# EAGLE design helilights_rev_1b_9-9-10 (EAGLE 5.10)
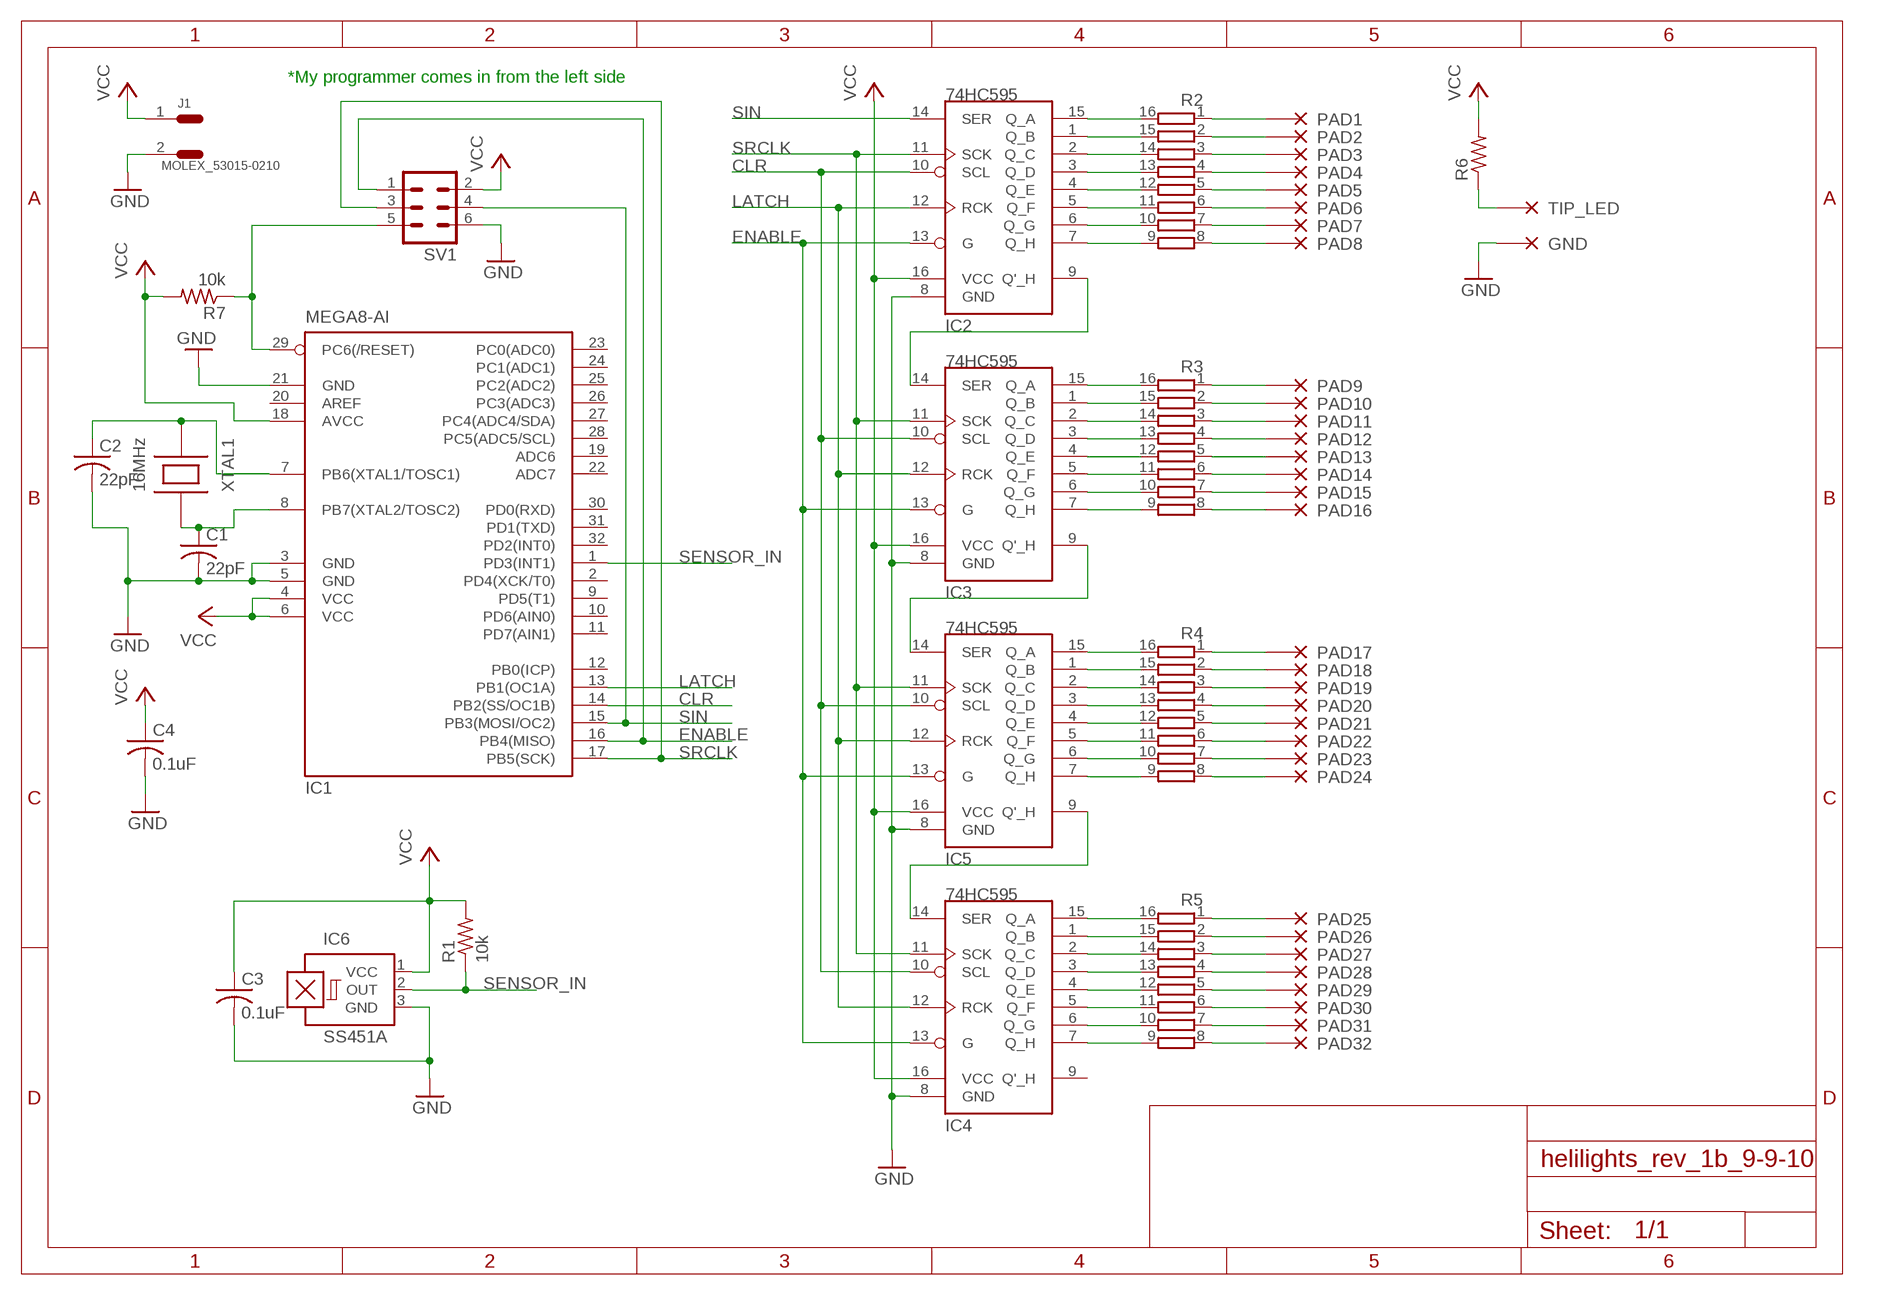
[diagram p0: schematic, sheet 1]

## Parts
C1  22pF  C-USC0603  [C0603]
C2  22pF  C-USC0603  [C0603]
C3  0.1uF  C-USC0603  [C0603]
C4  0.1uF  C-USC0603  [C0603]
GND  PAD_1X2MM  [1X2]
IC1  MEGA8-AI  [TQFP32-08]
IC2  74HC595  [TSSOP16]
IC3  74HC595  [TSSOP16]
IC4  74HC595  [TSSOP16]
IC5  74HC595  [TSSOP16]
IC6  SS451A  A1202LH  [SOT23-W]
J1  MOLEX_53015-0210  [53015-0210]
PAD1  PAD_1X2MM  [1X2]
PAD2  PAD_1X2MM  [1X2]
PAD3  PAD_1X2MM  [1X2]
PAD4  PAD_1X2MM  [1X2]
PAD5  PAD_1X2MM  [1X2]
PAD6  PAD_1X2MM  [1X2]
PAD7  PAD_1X2MM  [1X2]
PAD8  PAD_1X2MM  [1X2]
PAD9  PAD_1X2MM  [1X2]
PAD10  PAD_1X2MM  [1X2]
PAD11  PAD_1X2MM  [1X2]
PAD12  PAD_1X2MM  [1X2]
PAD13  PAD_1X2MM  [1X2]
PAD14  PAD_1X2MM  [1X2]
PAD15  PAD_1X2MM  [1X2]
PAD16  PAD_1X2MM  [1X2]
PAD17  PAD_1X2MM  [1X2]
PAD18  PAD_1X2MM  [1X2]
PAD19  PAD_1X2MM  [1X2]
PAD20  PAD_1X2MM  [1X2]
PAD21  PAD_1X2MM  [1X2]
PAD22  PAD_1X2MM  [1X2]
PAD23  PAD_1X2MM  [1X2]
PAD24  PAD_1X2MM  [1X2]
PAD25  PAD_1X2MM  [1X2]
PAD26  PAD_1X2MM  [1X2]
PAD27  PAD_1X2MM  [1X2]
PAD28  PAD_1X2MM  [1X2]
PAD29  PAD_1X2MM  [1X2]
PAD30  PAD_1X2MM  [1X2]
PAD31  PAD_1X2MM  [1X2]
PAD32  PAD_1X2MM  [1X2]
R1  10k  R-US_R0603  [R0603]
R2  4816P-T01  [4816P]
R3  4816P-T01  [4816P]
R4  4816P-T01  [4816P]
R5  4816P-T01  [4816P]
R6  R-US_0207/7  [0207/7]
R7  10k  R-US_0207/7  [0207/7]
SV1  MA03-2  [MA03-2]
TIP_LED  PAD_1X2MM  [1X2]
XTAL1  16MHz  CRYSTAL  [XTAL-6X3.3MM]

## Nets
CLR: IC1.14(PB2(SS/OC1B)) IC2.10(SCL) IC3.10(SCL) IC4.10(SCL) IC5.10(SCL)
ENABLE: IC1.16(PB4(MISO)) IC2.13(G) IC3.13(G) IC4.13(G) IC5.13(G) SV1.1
GND [Grounds]: C1.2 C2.2 C3.2 C4.2 GND.P$1(PAD) IC1.3(GND) IC1.5(GND) IC1.21(GND) IC2.8(GND) IC3.8(GND) IC4.8(GND) IC5.8(GND) IC6.3(GND) J1.2 SV1.6
LATCH: IC1.13(PB1(OC1A)) IC2.12(RCK) IC3.12(RCK) IC4.12(RCK) IC5.12(RCK)
N$1: C2.1 IC1.7(PB6(XTAL1/TOSC1)) XTAL1.2
N$2: C1.1 IC1.8(PB7(XTAL2/TOSC2)) XTAL1.1
N$3: IC2.15(Q_A) R2.16
N$4: IC2.1(Q_B) R2.15
N$5: IC2.9(Q'_H) IC3.14(SER)
N$6: IC3.9(Q'_H) IC5.14(SER)
N$7: IC4.14(SER) IC5.9(Q'_H)
N$8: IC2.2(Q_C) R2.14
N$9: IC2.3(Q_D) R2.13
N$10: IC2.4(Q_E) R2.12
N$11: IC2.5(Q_F) R2.11
N$12: IC2.6(Q_G) R2.10
N$13: IC2.7(Q_H) R2.9
N$14: IC3.15(Q_A) R3.16
N$15: IC3.1(Q_B) R3.15
N$16: IC3.2(Q_C) R3.14
N$17: IC3.3(Q_D) R3.13
N$18: IC3.4(Q_E) R3.12
N$19: IC3.5(Q_F) R3.11
N$20: IC3.6(Q_G) R3.10
N$21: IC3.7(Q_H) R3.9
N$22: IC5.15(Q_A) R4.16
N$23: IC5.1(Q_B) R4.15
N$24: IC5.2(Q_C) R4.14
N$25: IC5.3(Q_D) R4.13
N$26: IC5.4(Q_E) R4.12
N$27: IC5.5(Q_F) R4.11
N$28: IC5.6(Q_G) R4.10
N$29: IC5.7(Q_H) R4.9
N$30: IC4.15(Q_A) R5.16
N$31: IC4.1(Q_B) R5.15
N$32: IC4.2(Q_C) R5.14
N$33: IC4.3(Q_D) R5.13
N$34: IC4.4(Q_E) R5.12
N$35: IC4.5(Q_F) R5.11
N$36: IC4.6(Q_G) R5.10
N$37: IC4.7(Q_H) R5.9
N$38: PAD1.P$1(PAD) R2.1
N$39: PAD2.P$1(PAD) R2.2
N$40: PAD3.P$1(PAD) R2.3
N$41: PAD4.P$1(PAD) R2.4
N$42: PAD5.P$1(PAD) R2.5
N$43: PAD6.P$1(PAD) R2.6
N$44: PAD7.P$1(PAD) R2.7
N$45: PAD8.P$1(PAD) R2.8
N$46: PAD9.P$1(PAD) R3.1
N$47: PAD10.P$1(PAD) R3.2
N$48: PAD11.P$1(PAD) R3.3
N$49: PAD12.P$1(PAD) R3.4
N$50: PAD13.P$1(PAD) R3.5
N$51: PAD14.P$1(PAD) R3.6
N$52: PAD15.P$1(PAD) R3.7
N$53: PAD16.P$1(PAD) R3.8
N$54: PAD17.P$1(PAD) R4.1
N$55: PAD18.P$1(PAD) R4.2
N$56: PAD19.P$1(PAD) R4.3
N$57: PAD20.P$1(PAD) R4.4
N$58: PAD21.P$1(PAD) R4.5
N$59: PAD22.P$1(PAD) R4.6
N$60: PAD23.P$1(PAD) R4.7
N$61: PAD24.P$1(PAD) R4.8
N$62: PAD25.P$1(PAD) R5.1
N$63: PAD26.P$1(PAD) R5.2
N$64: PAD27.P$1(PAD) R5.3
N$65: PAD28.P$1(PAD) R5.4
N$66: PAD29.P$1(PAD) R5.5
N$67: PAD30.P$1(PAD) R5.6
N$68: PAD31.P$1(PAD) R5.7
N$69: PAD32.P$1(PAD) R5.8
N$70: R6.1 TIP_LED.P$1(PAD)
N$73: IC1.29(PC6(/RESET)) R7.1 SV1.5
SENSOR_IN: IC1.1(PD3(INT1)) IC6.2(OUT) R1.1
SIN: IC1.15(PB3(MOSI/OC2)) IC2.14(SER) SV1.4
SRCLK: IC1.17(PB5(SCK)) IC2.11(SCK) IC3.11(SCK) IC4.11(SCK) IC5.11(SCK) SV1.3
VCC [Power]: C3.1 C4.1 IC1.4(VCC) IC1.6(VCC) IC1.18(AVCC) IC2.16(VCC) IC3.16(VCC) IC4.16(VCC) IC5.16(VCC) IC6.1(VCC) J1.1 R1.2 R6.2 R7.2 SV1.2
Unconnected: IC1.2(PD4(XCK/T0)) IC1.9(PD5(T1)) IC1.10(PD6(AIN0)) IC1.11(PD7(AIN1)) IC1.12(PB0(ICP)) IC1.19(ADC6) IC1.20(AREF) IC1.22(ADC7) IC1.23(PC0(ADC0)) IC1.24(PC1(ADC1)) IC1.25(PC2(ADC2)) IC1.26(PC3(ADC3)) IC1.27(PC4(ADC4/SDA)) IC1.28(PC5(ADC5/SCL)) IC1.30(PD0(RXD)) IC1.31(PD1(TXD)) IC1.32(PD2(INT0)) IC4.9(Q'_H)

## Notes on the sheet
- *My programmer comes in from the left side

## Library data of the parts
C1-C4 = rcl:C-US: CAPACITOR, American symbol
GND PAD1-PAD32 TIP_LED = ZiwiskyLib:PAD_1X2MM: 1 x 2mm pad for wire connections
IC1 = atmel:MEGA8: MICROCONTROLLER 8 Kbytes FLASH, 1 kbytes SRAM, 512 bytes EEPROM, USART, 6-channel 10 bit ADC, 2-channel 8 bit ADC Pin compatible with Atmega48, ATMega88, ATMega168 Source: avr.lbr
IC2-IC5 = ZiwiskyLib:74HC595: 8-bit shift register with output latch
IC6 = allegro:A12*?: Hall-effect bipolar switch Source: http://www.allegromicro.com/en/Products/Part_Numbers/1202/1202.pdf
J1 = ZiwiskyLib:MOLEX_53015-0210
R1 = rcl:R-US_: RESISTOR, American symbol
R2-R5 = resistor-bourns:4816P-T01: BOURNS RESISTOR NETWORK
R6 R7 = resistor:R-US_: RESISTOR, American symbol
SV1 = con-lstb:MA03-2: PIN HEADER
XTAL1 = ZiwiskyLib:CRYSTAL: crystal

## Net classes
1 Grounds: width 0.508 mm
2 Power: width 0.508 mm

## Board
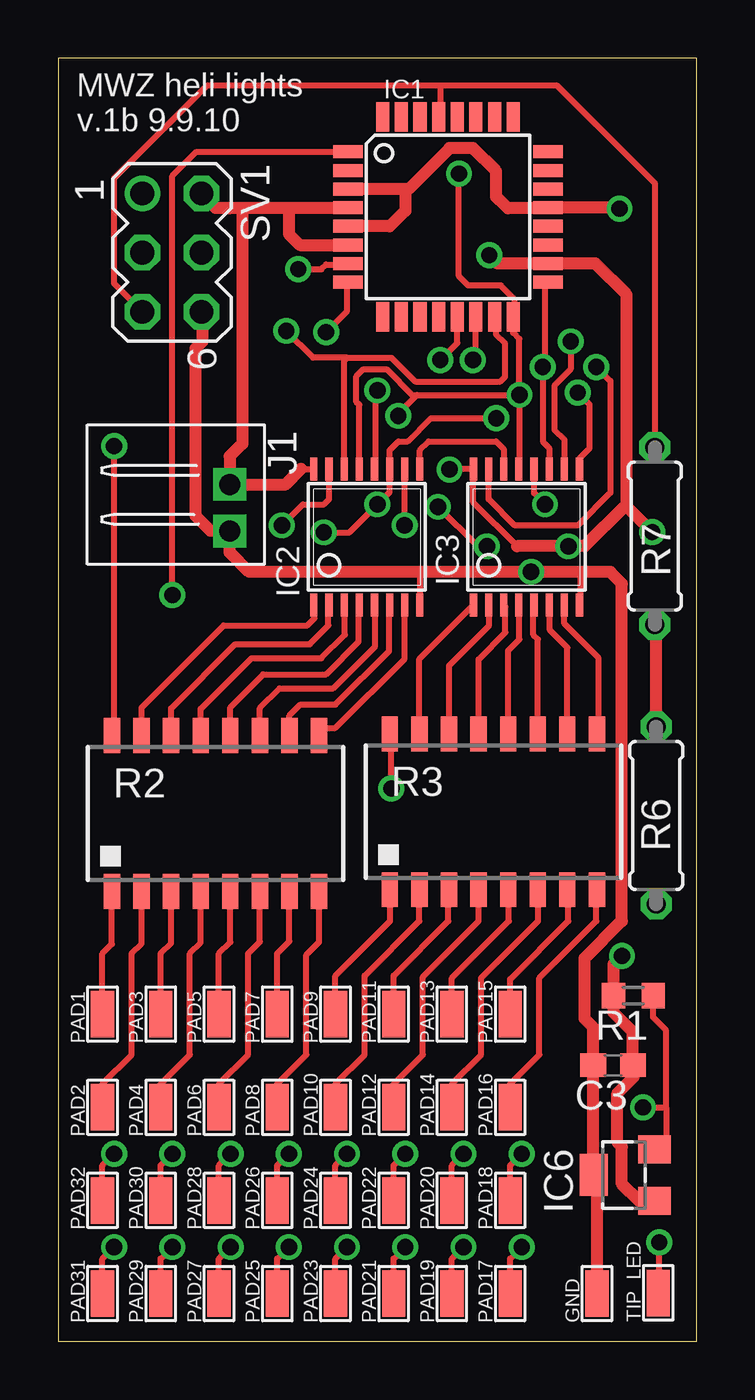
[diagram p1: board, top side]
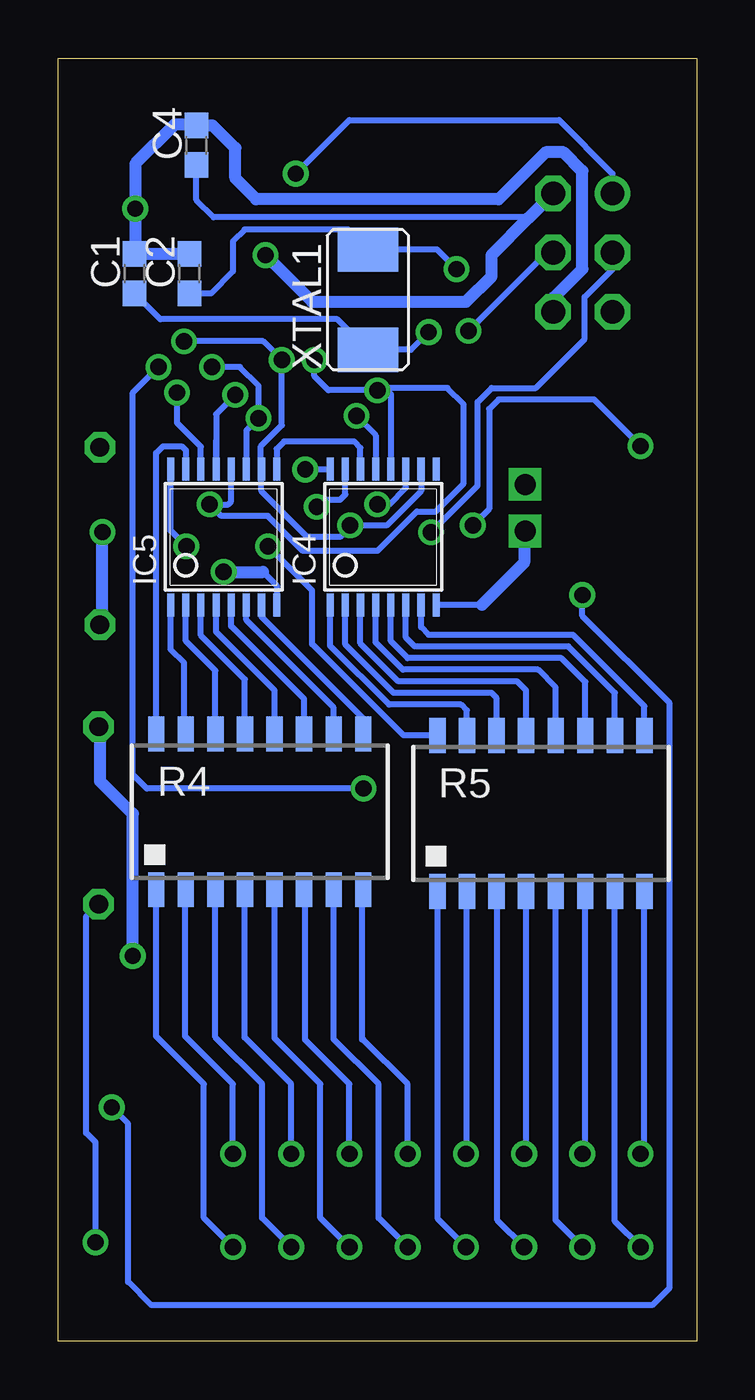
[diagram p2: board, bottom side, seen from below]

Size 27.4 x 55.1 mm. Coordinates in mm from the lower left corner, seen from the top.
Outline: 0,0 27.4,0 27.4,55.1 0,55.1 0,0
Copper layers (1*16): Top 0.035mm / dielectric 1.5mm / Bottom 0.035mm
Design rules "olimex_8mils": minimum track width 8mil, minimum drill 0.6mm, track to track 8mil, track to pad 8mil, pad to pad 8mil, via to via 8mil, smd to smd 8mil, copper to edge 40mil, drill to drill 10mil, minimum pad ring 10mil, minimum via ring 8mil, stop-mask expansion 0mil, vias tented up to drill 0mil, thermal gap 10mil

### Footprints (pad centres in the part's own frame; a part is rotated, then mirrored left to right if it is on the bottom)
C0603 = smd 1.1 x 1: 1 -0.85,0; 2 0.85,0
1X2 = smd 1 x 2: P$1 0,0
TQFP32-08 = smd 1.27 x 0.559: 1 -4.293,2.8; 2 -4.293,2; 3 -4.293,1.2; 4 -4.293,0.4; 5 -4.293,-0.4; 6 -4.293,-1.2; 7 -4.293,-2; 8 -4.293,-2.8; 17 4.293,-2.8; 18 4.293,-2; 19 4.293,-1.2; 20 4.293,-0.4; 21 4.293,0.4; 22 4.293,1.2; 23 4.293,2; 24 4.293,2.8 | smd 0.559 x 1.27: 9 -2.8,-4.293; 10 -2,-4.293; 11 -1.2,-4.293; 12 -0.4,-4.293; 13 0.4,-4.293; 14 1.2,-4.293; 15 2,-4.293; 16 2.8,-4.293; 25 2.8,4.293; 26 2,4.293; 27 1.2,4.293; 28 0.4,4.293; 29 -0.4,4.293; 30 -1.2,4.293; 31 -2,4.293; 32 -2.8,4.293
TSSOP16 = smd 0.305 x 0.991: 1 -2.275,-2.918; 2 -1.625,-2.918; 3 -0.975,-2.918; 4 -0.325,-2.918; 5 0.325,-2.918; 6 0.975,-2.918; 7 1.625,-2.918; 8 2.275,-2.918; 9 2.275,2.918; 10 1.625,2.918; 11 0.975,2.918; 12 0.325,2.918; 13 -0.325,2.918; 14 -0.975,2.918; 15 -1.625,2.918; 16 -2.275,2.918
SOT23-W = smd 1.2 x 1.4: 1 -1.1,-1.3; 2 1.1,-1.3 | smd 1.8 x 1.2: 3 0,1.3
53015-0210 = drill 0.9 square: 1 0,0; 2 2,0
R0603 = smd 1 x 1.1: 1 -0.85,0; 2 0.85,0
4816P = smd 0.7 x 1.5: 1 -4.445,-3.346; 2 -3.175,-3.346; 3 -1.905,-3.346; 4 -0.635,-3.346; 5 0.635,-3.346; 6 1.905,-3.346; 7 3.175,-3.346; 8 4.445,-3.346; 9 4.445,3.346; 10 3.175,3.346; 11 1.905,3.346; 12 0.635,3.346; 13 -0.635,3.346; 14 -1.905,3.346; 15 -3.175,3.346; 16 -4.445,3.346
0207/7 = drill 0.813 octagon: 1 -3.81,0; 2 3.81,0
MA03-2 = drill 1.016 round: 1 -2.54,-1.27 | drill 1.016 octagon: 2 -2.54,1.27; 3 0,-1.27; 4 0,1.27; 5 2.54,-1.27; 6 2.54,1.27
XTAL-6X3.3MM = smd 1.9 x 2.6: 1 -2.15,0; 2 2.15,0

### Placement (x,y rotation side)
C1  24.12,45.85 90 bottom
C2  21.77,45.85 90 bottom
C3  23.82,11.86 180 top
C4  21.47,51.36 90 bottom
GND  23.13,2.05 0 top
IC1  16.73,48.28 0 top
IC2  13.25,34.54 0 top
IC3  20.1,34.54 0 top
IC4  13.45,34.54 0 bottom
IC5  20.3,34.54 0 bottom
IC6  24.29,7.14 90 top
J1  7.36,36.8 270 top
PAD1  1.9,14.05 0 top
PAD2  1.9,10.05 0 top
PAD3  4.4,14.05 0 top
PAD4  4.4,10.05 0 top
PAD5  6.9,14.05 0 top
PAD6  6.9,10.05 0 top
PAD7  9.4,14.05 0 top
PAD8  9.4,10.05 0 top
PAD9  11.9,14.05 0 top
PAD10  11.9,10.05 0 top
PAD11  14.4,14.05 0 top
PAD12  14.4,10.05 0 top
PAD13  16.9,14.05 0 top
PAD14  16.9,10.05 0 top
PAD15  19.4,14.05 0 top
PAD16  19.4,10.05 0 top
PAD17  19.4,2.05 0 top
PAD18  19.4,6.05 0 top
PAD19  16.9,2.05 0 top
PAD20  16.9,6.05 0 top
PAD21  14.4,2.05 0 top
PAD22  14.4,6.05 0 top
PAD23  11.9,2.05 0 top
PAD24  11.9,6.05 0 top
PAD25  9.4,2.05 0 top
PAD26  9.4,6.05 0 top
PAD27  6.9,2.05 0 top
PAD28  6.9,6.05 0 top
PAD29  4.4,2.05 0 top
PAD30  4.4,6.05 0 top
PAD31  1.9,2.05 0 top
PAD32  1.9,6.05 0 top
R1  24.69,14.85 180 top
R2  6.75,22.67 0 top
R3  18.68,22.74 0 top
R4  18.75,22.74 0 bottom
R5  6.68,22.67 0 bottom
R6  25.67,22.58 90 top
R7  25.61,34.58 270 top
SV1  4.88,46.75 270 top
TIP_LED  25.76,2.08 0 top
XTAL1  14.11,44.73 90 bottom

### Tracks (layer width: path | path; a pad name or v marks a point on that pad's centre or on a via)
CLR  (via drill 0.7)
  Top 0.254: v14.87,35.04 14.87,37.58 IC2.10 | IC1.14 17.93,42.27 v17.8,42.14 | IC3.10 21.73,38.72 21.3,39.14 21.3,41.04 22,41.74 v22,42.94
  Bottom 0.254: IC4.10 11.82,36.52 13.3,35.04 v14.87,35.04 14.87,34.97 15.3,34.54 16.71,34.54 18.68,36.51 18.68,37.58 IC5.10 18.7,37.48 18.7,38.44 17.8,39.34 v17.8,42.14 18.6,42.94 v22,42.94
ENABLE  (via drill 0.7)
  Top 0.254: IC1.16 19.53,43.31 19.8,43.04 v19.8,40.64 | v19.8,40.64 19.8,37.48 IC3.13 | IC1.16 19.5,44.02 | v17.2,50.14 17.2,45.74 17.6,45.34 19,45.34 19.6,44.74 19.6,44.06 IC1.16 | IC2.13 12.93,40.22 12.8,40.34 12.8,41.44 13.1,41.74 14.1,41.74 15.2,40.64 15.4,40.64 | 15.4,40.64 v19.8,40.64 | v14.6,39.74 14.6,39.84 15.4,40.64
  Bottom 0.254: SV1.1 3.61,50.15 5.9,52.44 14.9,52.44 v17.2,50.14 | IC4.13 13.78,38.91 v14.6,39.74 | 20.62,38.66 IC5.13 20.62,39.81 v19.8,40.64
GND  (via drill 0.7)
  Top 0.254: IC3.8 22.4,31.65 22.4,33.04 | IC2.8 15.53,32.91 15.4,33.04 | 6.2,44.16 SV1.6
  Top 0.508: 14.9,49.48 IC1.3 | 14.9,49.48 15.04,49.48 16.8,51.24 17.8,51.24 18.8,50.24 18.8,49.14 18.9,49.04 18.91,49.04 19.3,48.65 20.79,48.65 IC1.21 24.05,48.68 v24.09,48.64 v24.1,48.65 | J1.2 6.54,34.8 5.9,35.44 5.9,42.64 6.2,42.94 6.2,44.16 | IC1.5 14.23,47.88 14.9,48.55 14.9,49.48 | J1.2 7.4,34.76 | J1.2 7.36,33.89 8.21,33.04 15.4,33.04 v20.3,33.04 22.4,33.04 23.7,33.04 24.2,32.54 24.2,18.05 22.6,16.45 22.6,13.85 22.97,13.48 C3.2 22.97,7.16 IC6.3 23.13,7 GND.P$1
  Bottom 0.254: IC5.8 18.02,32.47 18.6,33.04 | 9.22,31.62 IC4.8 | J1.2 7.4,34.76
  Bottom 0.508: C2.2 C1.2 24.09,46.73 v24.09,48.64 24.09,50.56 22.4,52.25 21.51,52.25 C4.2 20.77,52.21 19.8,51.24 19.8,49.94 18.9,49.04 8.49,49.04 6.47,51.06 5.71,51.06 4.9,50.25 4.9,46.05 6.15,44.8 SV1.6 | v20.3,33.04 18.6,33.04 | 9.22,31.62 7.4,33.44 7.4,34.76
LATCH  (via drill 0.7)
  Top 0.254: IC1.13 17.13,42.87 v16.4,42.14 | v13.7,40.84 13.6,40.74 13.6,37.48 IC2.12 | IC3.12 20.43,36.41 v20.9,35.94
  Bottom 0.254: v16.4,42.14 16.4,41.44 15.8,40.84 v13.7,40.84 13.6,40.94 13.4,40.94 | 13.1,37.48 IC4.12 13.12,40.66 13.4,40.94 | 13.4,40.94 10.7,40.94 10,40.24 10,36.84 11.2,35.64 12,35.64 13.7,33.94 16.9,33.94 18.4,35.44 20.4,35.44 v20.9,35.94 20.1,35.94 19.98,36.06 IC5.12
N$1  (via drill 0.7)
  Top 0.254: v10.3,46.04 11.3,46.04 11.5,46.24 12.4,46.24 IC1.7
  Bottom 0.254: v10.3,46.04 11.14,46.88 XTAL1.2 14.97,47.74 19.4,47.74 19.9,47.24 19.9,45.94 20.84,45 C2.1
N$2  (via drill 0.7)
  Top 0.254: IC1.8 12.4,45.44 12.4,44.24 v11.5,43.34
  Bottom 0.254: v11.5,43.34 12.26,42.58 XTAL1.1 15.42,43.89 23.01,43.89 C1.1
N$3  (via drill 0.7)
  Top 0.254: R2.16 2.31,26.34 2.4,26.44 v2.4,38.44 | IC2.15 11.62,36.16 11.4,35.94 10.5,35.94 v9.6,35.04
  Bottom 0.254: v9.6,35.04 8.9,35.74 8.9,40.04 8.5,40.44 4.4,40.44 v2.4,38.44
N$4
  Top 0.254: IC2.1 11,31.6 11,31.04 10.7,30.74 7.1,30.74 3.58,27.21 R2.15
N$5
  Top 0.254: IC2.9 15.53,38.27 15.9,38.64 18.8,38.64 19.12,38.31 IC3.14
N$6  (via drill 0.7)
  Top 0.254: IC3.9 22.38,37.91 22.8,38.34 22.8,40.24 v22.3,40.74
  Bottom 0.254: IC5.14 21.27,38.41 22.3,39.44 v22.3,40.74
N$7
  Bottom 0.254: IC4.14 14.43,38.37 14.7,38.64 17.7,38.64 18.02,38.31 IC5.9
N$8
  Top 0.254: IC2.2 11.6,31.6 11.6,30.74 10.8,29.94 7.6,29.94 4.84,27.18 R2.14
N$9
  Top 0.254: IC2.3 12.3,31.6 12.3,30.34 11.3,29.34 8.3,29.34 6.12,27.16 R2.13
N$10
  Top 0.254: IC2.4 12.9,31.6 12.9,30.04 11.5,28.64 8.8,28.64 7.38,27.23 R2.12
N$11
  Top 0.254: IC2.5 13.6,31.6 13.6,29.84 11.8,28.04 9.5,28.04 8.65,27.2 R2.11
N$12
  Top 0.254: IC2.6 14.2,31.6 14.2,29.64 11.9,27.34 10.4,27.34 9.93,26.86 R2.10
N$13
  Top 0.254: IC2.7 14.87,31.23 14.87,29.31 11.9,26.34 11.52,26.34 R2.9
N$14  (via drill 0.7)
  Top 0.254: IC3.15 18.48,36.16 19.6,35.04 22.3,35.04 23.7,36.44 23.7,41.24 v23.1,41.84 | v14.3,23.74 14.3,26.02 R3.16
  Bottom 0.254: v14.3,23.74 23.6,23.74 24.2,24.34 24.2,40.74 v23.1,41.84
N$15
  Top 0.254: R3.15 15.51,29.3 IC3.1
N$16
  Top 0.254: R3.14 16.77,29.02 18.5,30.74 18.5,31.6 IC3.2
N$17
  Top 0.254: R3.13 18.05,29.29 19.2,30.44 19.2,31.55 IC3.3
N$18
  Top 0.254: R3.12 19.32,29.66 19.8,30.14 19.8,31.6 IC3.4
N$19
  Top 0.254: R3.11 20.59,30.16 20.4,30.34 20.4,31.6 IC3.5
N$20
  Top 0.254: R3.10 21.86,29.79 21.1,30.54 21.1,31.6 IC3.6
N$21
  Top 0.254: IC3.7 21.73,30.82 23.2,29.34 23.2,26.16 R3.9
N$22
  Bottom 0.254: R4.16 23.2,38.15 22.9,38.44 22.1,38.44 21.93,38.27 IC5.15
N$23
  Bottom 0.254: IC5.1 22.57,29.71 22,29.14 22,26.16 R4.15
N$24
  Bottom 0.254: R4.14 20.66,28.8 21.93,30.07 IC5.2
N$25
  Bottom 0.254: R4.13 19.39,28.43 21.27,30.32 IC5.3
N$26
  Bottom 0.254: R4.12 18.11,27.95 20.62,30.46 IC5.4
N$27
  Bottom 0.254: R4.11 16.84,27.59 19.98,30.71 IC5.5
N$28
  Bottom 0.254: R4.10 15.57,27.21 19.32,30.96 IC5.6
N$29
  Bottom 0.254: R4.9 14.3,26.75 18.68,31.11 IC5.7 18.7,31.6
N$30  (via drill 0.7)
  Top 0.254: v16.3,35.84 18,34.14 v18.4,34.14
  Bottom 0.254: R5.16 12.58,26.02 16.5,29.94 16.5,32.24 v18.4,34.14 | IC4.15 15.07,36.37 15.3,36.14 16,36.14 v16.3,35.84
N$31
  Bottom 0.254: R5.15 9.86,27.09 10.1,27.34 13.2,27.34 15.72,29.86 IC4.1
N$32
  Bottom 0.254: R5.14 8.59,27.62 8.8,27.84 13,27.84 15.07,29.91 IC4.2
N$33
  Bottom 0.254: R5.13 7.32,27.95 7.7,28.34 12.8,28.34 14.43,29.96 IC4.3
N$34
  Bottom 0.254: R5.12 6.04,28.09 6.8,28.84 12.6,28.84 13.78,30.02 IC4.4
N$35
  Bottom 0.254: R5.11 4.78,28.32 5.8,29.34 12.4,29.34 13.12,30.07 IC4.5
N$36
  Bottom 0.254: R5.10 3.5,27.84 5.5,29.84 12.1,29.84 12.47,30.21 IC4.6
N$37
  Bottom 0.254: R5.9 2.23,27.27 5.3,30.34 11.5,30.34 11.82,30.66 IC4.7
N$38
  Top 0.254: PAD1.P$1 1.9,16.65 2.31,17.05 R2.1
N$39
  Top 0.254: R2.2 3.58,17.07 3.15,16.65 3.15,12.3 1.9,11.05 PAD2.P$1
N$40
  Top 0.254: PAD3.P$1 4.4,16.65 4.84,17.09 R2.3
N$41
  Top 0.254: R2.4 6.12,17.11 5.65,16.65 5.65,12.3 4.4,11.05 PAD4.P$1
N$42
  Top 0.254: PAD5.P$1 6.9,16.65 7.38,17.14 R2.5
N$43
  Top 0.254: R2.6 8.65,17.16 8.15,16.65 8.15,12.3 6.9,11.05 PAD6.P$1
N$44
  Top 0.254: PAD7.P$1 9.4,16.65 9.93,17.18 R2.7
N$45
  Top 0.254: R2.8 11.2,17.14 10.65,16.6 10.65,12.3 9.4,11.05 PAD8.P$1
N$46
  Top 0.254: 14.4,19.23 R3.1 14.25,19.38 14.25,18.05 11.9,15.7 PAD9.P$1
N$47
  Top 0.254: 15.4,19.29 R3.2 15.5,18.05 13.15,15.7 13.15,12.3 11.9,11.05 PAD10.P$1
N$48
  Top 0.254: PAD11.P$1 14.4,15.7 16.75,18.05 16.75,19.37 R3.3
N$49
  Top 0.254: R3.4 18.05,18.05 15.65,15.65 15.65,12.3 14.4,11.05 PAD12.P$1
N$50
  Top 0.254: PAD13.P$1 16.9,15.6 19.35,18.05 19.35,19.36 R3.5
N$51
  Top 0.254: R3.6 20.6,18.05 18.15,15.6 18.15,12.3 16.9,11.05 PAD14.P$1
N$52
  Top 0.254: PAD15.P$1 19.4,15.55 21.9,18.05 21.9,19.35 R3.7
N$53
  Top 0.254: R3.8 23.1,19.37 23.1,18.05 20.65,15.6 20.65,12.3 19.4,11.05 PAD16.P$1
N$54  (via drill 0.7)
  Top 0.254: PAD17.P$1 19.4,3.55 v19.9,4.05
  Bottom 0.254: R4.1 23.2,13.1 21.15,11.05 21.15,5.3 v19.9,4.05
N$55  (via drill 0.7)
  Top 0.254: v19.9,8.05 19.4,7.55 PAD18.P$1
  Bottom 0.254: R4.2 21.95,19.37 21.95,13.1 19.9,11.05 v19.9,8.05
N$56  (via drill 0.7)
  Top 0.254: PAD19.P$1 16.9,3.55 v17.4,4.05
  Bottom 0.254: R4.3 20.66,13.05 18.65,11.05 18.65,5.3 v17.4,4.05
N$57  (via drill 0.7)
  Top 0.254: v17.4,8.05 16.9,7.55 PAD20.P$1
  Bottom 0.254: R4.4 19.4,13.05 17.4,11.05 v17.4,8.05
N$58  (via drill 0.7)
  Top 0.254: PAD21.P$1 14.4,3.55 v14.9,4.05
  Bottom 0.254: R4.5 18.11,13.02 16.15,11.05 16.15,5.3 v14.9,4.05
N$59  (via drill 0.7)
  Top 0.254: v14.9,8.05 14.4,7.55 PAD22.P$1
  Bottom 0.254: R4.6 16.8,19.35 16.8,12.95 14.9,11.05 v14.9,8.05
N$60  (via drill 0.7)
  Top 0.254: PAD23.P$1 11.9,3.55 v12.4,4.05
  Bottom 0.254: R4.7 15.57,12.97 13.65,11.05 13.65,5.3 v12.4,4.05
N$61  (via drill 0.7)
  Top 0.254: v12.4,8.05 11.9,7.55 PAD24.P$1
  Bottom 0.254: R4.8 14.35,19.35 14.35,12.95 14.3,12.95 12.4,11.05 v12.4,8.05
N$62  (via drill 0.7)
  Top 0.254: PAD25.P$1 9.4,3.55 v9.9,4.05
  Bottom 0.254: R5.1 11.1,19.3 11.1,5.25 v9.9,4.05
N$63  (via drill 0.7)
  Top 0.254: v9.9,8.05 9.4,7.55 PAD26.P$1
  Bottom 0.254: R5.2 9.86,8.1 v9.9,8.05
N$64  (via drill 0.7)
  Top 0.254: PAD27.P$1 6.9,3.55 v7.4,4.05
  Bottom 0.254: R5.3 8.55,19.29 8.55,5.2 v7.4,4.05
N$65  (via drill 0.7)
  Top 0.254: v7.4,8.05 6.9,7.55 PAD28.P$1
  Bottom 0.254: R5.4 7.32,8.13 v7.4,8.05
N$66  (via drill 0.7)
  Top 0.254: PAD29.P$1 4.4,3.55 v4.9,4.05
  Bottom 0.254: R5.5 6.04,5.2 v4.9,4.05
N$67  (via drill 0.7)
  Top 0.254: v4.9,8.05 4.4,7.55 PAD30.P$1
  Bottom 0.254: R5.6 4.78,8.18 v4.9,8.05
N$68  (via drill 0.7)
  Top 0.254: PAD31.P$1 1.9,3.55 v2.4,4.05
  Bottom 0.254: R5.7 3.5,5.15 v2.4,4.05
N$69  (via drill 0.7)
  Top 0.254: PAD32.P$1 1.9,7.55 v2.4,8.05
  Bottom 0.254: R5.8 2.23,8.21 v2.4,8.05
N$70  (via drill 0.7)
  Top 0.254: v25.8,4.25 25.8,2.12 TIP_LED.P$1
  Bottom 0.254: v25.8,4.25 25.8,8.55 26.2,8.95 26.2,18.24 R6.1
N$73
  Top 0.254: SV1.5 2.4,45.42 2.4,49.94 6.4,53.94 16.4,53.94 | R7.1 25.61,49.73 21.4,53.94 16.4,53.94 | IC1.29 16.4,52.57 16.4,53.94
SENSOR_IN  (via drill 0.7)
  Top 0.254: R1.1 25.54,13.91 26.1,13.35 26.1,10.05 | 26.1,10.05 26.1,8.55 IC6.2 | IC1.1 5.93,51.08 4.9,50.05 v4.9,32.05 | v25.1,10.05 26.1,10.05
  Bottom 0.254: v4.9,32.05 4.9,31.15 1.15,27.4 1.15,2.3 1.9,1.55 23.4,1.55 24.4,2.55 24.4,9.35 v25.1,10.05
SIN  (via drill 0.7)
  Top 0.254: IC1.15 18.8,43.92 18.8,43.24 19.18,42.86 19.18,41.42 18.98,41.22 15.32,41.22 14.3,42.24 12.4,42.24 | 12.4,42.24 10.94,42.24 v9.79,43.39 | IC2.14 12.28,42.12 12.4,42.24
  Bottom 0.254: v9.79,43.39 6.43,46.75 SV1.4
SRCLK  (via drill 0.7)
  Top 0.254: v11.4,34.74 12.5,34.74 v13.7,35.94 14.22,36.47 IC2.11 14.22,38.27 14.6,38.64 15,38.64 16,39.64 v18.8,39.64 | IC1.17 20.9,45.36 20.9,41.94 v20.8,41.84 20.8,38.64 21.07,38.37 IC3.11
  Bottom 0.254: SV1.3 3.61,46.03 4.8,44.84 4.8,43.04 6.9,40.94 8.8,40.94 9.4,40.34 9.4,36.74 v11.4,34.74 | IC4.11 12.47,36.66 13.2,35.94 v13.7,35.94 | IC5.11 19.32,39.12 v18.8,39.64 18.8,41.04 19.6,41.84 v20.8,41.84
VCC  (via drill 0.7)
  Top 0.254: 10.42,37.46 IC2.16 | 19.7,34.14 17.82,36.02 IC3.16 16.82,37.46 v16.8,37.44
  Top 0.508: v18.5,46.64 18.86,46.28 IC1.18 23.06,46.28 24.4,44.94 24.4,35.85 | 19.7,34.14 v21.9,34.14 22.6,34.14 24.31,35.85 24.4,35.85 | 10.42,37.46 9.76,36.8 J1.1 7.36,38.01 7.9,38.55 7.9,48.68 | R6.2 25.67,30.71 R7.2 | IC6.1 24.91,6.04 24.2,6.75 24.2,8.35 24,8.55 24,10.65 24.7,11.35 24.7,11.83 C3.1 24.67,13.28 23.84,14.11 R1.2 23.84,16.19 v24.2,16.55 | 7.4,48.68 6.76,48.68 SV1.2 | 7.4,48.68 7.9,48.68 | 7.9,48.68 9.9,48.68 | 9.9,48.68 IC1.4 | IC1.6 10.37,47.08 9.9,47.55 9.9,48.68 | 7.4,48.68 7.36,48.64 | v25.5,34.75 24.4,35.85
  Bottom 0.254: IC5.16 22.57,34.81 v21.9,34.14 | IC4.16 16.78,37.46 v16.8,37.44 | 7.17,48.27 20.73,48.27 21.47,49.01 C4.1
  Bottom 0.508: v24.2,16.55 24.2,22.65 25.6,24.05 25.6,26.32 R6.2 | SV1.2 7.17,48.27 8.8,46.64 8.8,45.74 9.9,44.64 16.5,44.64 v18.5,46.64 | v25.5,34.75 25.5,30.88 R7.2

### Text on the board
tNames: MWZ heli lights | v.1b 9.9.10